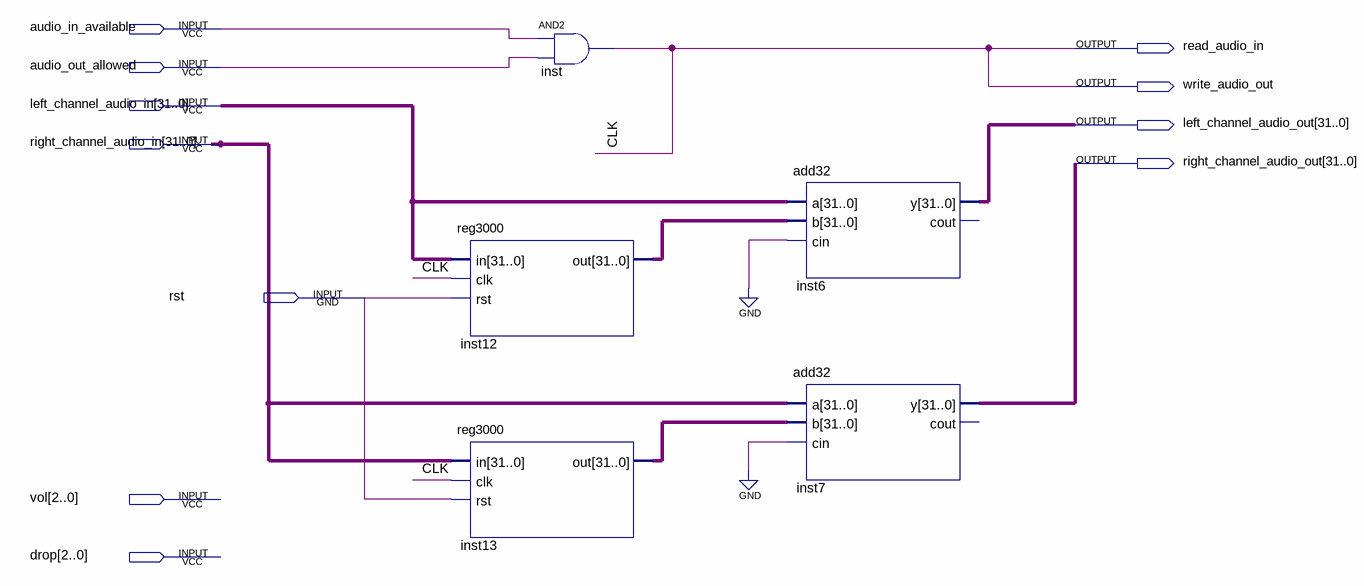
[diagram p0: schematic sheet]
// Quartus schematic filter_demo.bdf as structural Verilog: 5 symbols, 11 pins
module filter_demo (
  input  audio_in_available,
  input  audio_out_allowed,
  input  [31:0] left_channel_audio_in,
  input  [31:0] right_channel_audio_in,
  input  rst,
  input  [2:0] vol,
  input  [2:0] drop,
  output read_audio_in,
  output write_audio_out,
  output [31:0] left_channel_audio_out,
  output [31:0] right_channel_audio_out
);

  wire [31:0] inst12_out, inst13_out;

  reg3000 inst12 (.in(left_channel_audio_in), .clk(read_audio_in), .rst(rst), .out(inst12_out));
  reg3000 inst13 (.in(right_channel_audio_in), .clk(read_audio_in), .rst(rst), .out(inst13_out));
  and inst (read_audio_in, audio_in_available, audio_out_allowed);
  add32 inst6 (.a(left_channel_audio_in), .b(inst12_out), .cin(1'b0), .y(left_channel_audio_out));  // open: cout
  add32 inst7 (.a(right_channel_audio_in), .b(inst13_out), .cin(1'b0), .y(right_channel_audio_out));  // open: cout

  assign write_audio_out = read_audio_in;

  // Other names for the same wires on the sheet: CLK = read_audio_in
endmodule
